# EAGLE design Li-ion charger w protection TP4056 (EAGLE 7.3.0)
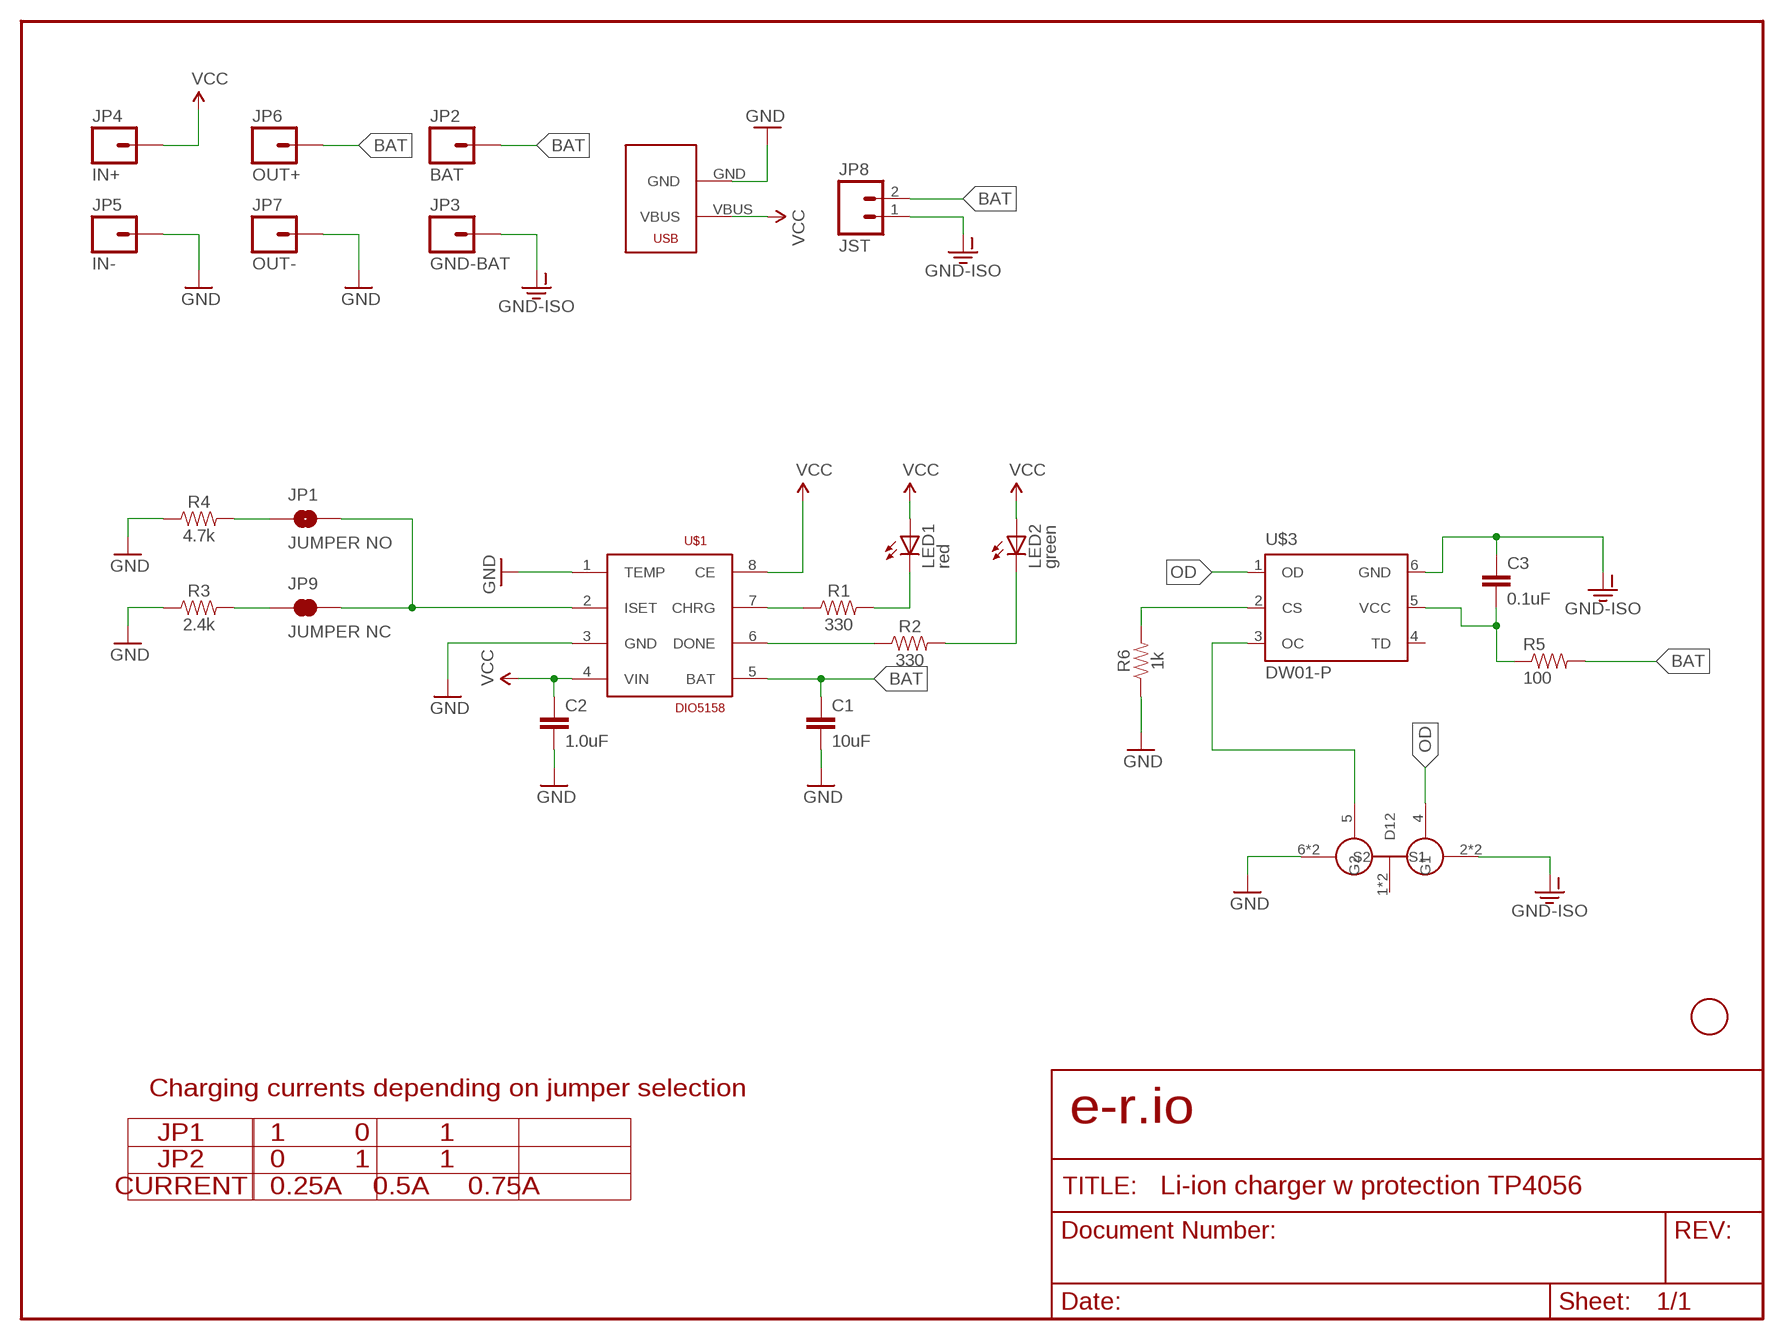
[diagram p0: schematic, sheet 1]

## Parts
C1  10uF  10UF-1206-6.3V-20%  [1206]
C2  1.0uF  1.0UF-0603-16V-10%  [0603]
C3  0.1uF  0.1UF-0603-25V-5%  [0603]
JP1  JUMPER NO  JUMPER-SMT_2_NO_NO-SILK  [SMT-JUMPER_2_NO_NO-SILK]
JP2  BAT  M01PTH  [1X01]
JP3  GND-BAT  M01PTH  [1X01]
JP4  IN+  M01PTH  [1X01]
JP5  IN-  M01PTH  [1X01]
JP6  OUT+  M01PTH  [1X01]
JP7  OUT-  M01PTH  [1X01]
JP8  JST  M02-JST-2MM-SMT  [JST-2-SMD]
JP9  JUMPER NC  JUMPER-SMT_2_NC_TRACE_NO-SILK  [SMT-JUMPER_2_NC_TRACE_NO-SILK]
LED1  red  LEDCHIP-LED0805  [CHIP-LED0805]
LED2  green  LEDCHIP-LED0805  [CHIP-LED0805]
R1  330  330OHM-0603-1/10W-1%  [0603]
R2  330  330OHM-0603-1/10W-1%  [0603]
R3  2.4k  2.49KOHM-0603-1/10W-1%  [0603]
R4  4.7k  4.7KOHM-0603-1/10W-1%  [0603]
R5  100  RESISTOR0603-RES  [0603-RES]
R6  1k  1KOHM-0603-1/10W-1%  [0603]
U$1  DIO5158  [SOIC-8]
U$2  FIDUCIAL  [FIDUCIAL_1MM]
U$3  DW01-P  [SOT23-6L]
U$4  FS8205A  [TSSOP8]
U$5  USB-MICROB-POWERONLY  [USB-MICROB-POWERONLY]

## Nets
BAT: C1.1 JP2.1 JP6.1 JP8.2 R5.2 U$1.5(BAT)
CHRG: R1.1 U$1.7(CHRG)
DONE: R2.1 U$1.6(DONE)
GND: C1.2 C2.2 JP5.1 JP7.1 R3.1 R4.1 R6.1 U$1.1(TEMP) U$1.3(GND) U$4.6(S2) U$4.7(S2) U$5.GND
GND-ISO: C3.1 JP3.1 JP8.1 U$3.6(GND) U$4.2(S1) U$4.3(S1)
ISET: JP1.2 JP9.2 U$1.2(ISET)
LED1: LED1.C R1.2
LED2: LED2.C R2.2
N$1: R6.2 U$3.2(CS)
N$2: U$3.3(OC) U$4.5(G2)
N$8: JP9.1 R3.2
N$9: JP1.1 R4.2
OD: U$3.1(OD) U$4.4(G1)
VCC: C2.1 JP4.1 LED1.A LED2.A U$1.4(VIN) U$1.8(CE) U$5.VBUS
VCC-DW: C3.2 R5.1 U$3.5(VCC)
Unconnected: U$3.4(TD) U$4.1(D12) U$4.8(D12)

## Notes on the sheet
- Charging currents depending on jumper selection
- e-r.io
- JP1
  JP2
  CURRENT
- 1         0         1
  0         1         1
  0.25A    0.5A     0.75A

## Library data of the parts
C1 = SparkFun-Capacitors:10UF: 10.0µF ceramic capacitors A capacitor is a passive two-terminal electrical component used to store electrical energy temporarily in an electric field.; PROD_ID: CAP-10057
C2 = SparkFun-Capacitors:1.0UF: 1µF ceramic capacitors A capacitor is a passive two-terminal electrical component used to store electrical energy temporarily in an electric field.; PROD_ID: CAP-00868
C3 = SparkFun-Capacitors:0.1UF: 0.1µF ceramic capacitors A capacitor is a passive two-terminal electrical component used to store electrical energy temporarily in an electric field.; PROD_ID: CAP-08604
JP1 = SparkFun-Jumpers:JUMPER-SMT_2_NO: Normally open jumper This jumper has two pads in close proximity to each other. Apply solder to close the connection. Round pads are easier to solder for beginners, but are a lot larger. SparkFun Product that uses the round pads: SparkFun EL Sequencer <https://www.sparkfun.com/products/12781>
JP2-JP7 = SparkFun:M01: Header 1 Standard 1-pin 0.1" header. Use with straight break away headers (SKU : PRT-00116), right angle break away headers (PRT-00553), swiss pins (PRT-00743), machine pins (PRT-00117), and female headers (PRT-00115).
JP8 = SparkFun:M02: Header 2 Standard 2-pin 0.1" header. Use with straight break away headers (SKU : PRT-00116), right angle break away headers (PRT-00553), swiss pins (PRT-00743), machine pins (PRT-00117), and female headers (PRT-00115). Molex polarized connector foot print use with SKU : PRT-08233 with associated crimp pins and housings.
JP9 = SparkFun-Jumpers:JUMPER-SMT_2_NC_TRACE: Normally closed trace jumper This jumper has a trace between two pads so it's normally closed (NC). Use a razor knife to open the connection. For best results follow the IPC guidelines for cutting traces: Cutout at least 0.063 mm (0.005 in). Remove all loose material to clean up the cut area. Seal the cut with an approved epoxy. Reapply solder to reclose the connection.
LED1 LED2 = adafruit:LED: LED OSRAM: - CHIPLED LG R971, LG N971, LY N971, LG Q971, LY Q971, LO R971, LY R971 LH N974, LH R974 LS Q976, LO Q976, LY Q976 LO Q996 - Hyper CHIPLED LW Q18S LB Q993, LB Q99A, LB R99A - SideLED LS A670, LO A670, LY A670, LG A670, LP A670 LB A673, LV A673, LT A673, LW A673 LH A674 LY A675 LS A676, LA A676, LO A676, LY A676, LW A676 LS A679, LY A679, LG A679 - Hyper Micro SIDELED® LS Y876, LA Y876, LO Y876, LY Y876 LT Y87S - SmartLED LW L88C, LW L88S LB L89C, LB L89S, LG L890 LS L89K, LO L89K, LY L89K LS L896, LA L896, LO L896, LY L896 - TOPLED LS T670, LO T670, LY T670, LG T670, LP T670 LSG T670, LSP T670, LSY T670, LOP T670, LYG T670 LG T671, LOG T671, LSG T671 LB T673, LV T673, LT T673, LW T673 LH T674 LS T676, LA T676, LO T676, LY T676, LB T676, LH T676, LSB T676, LW T676 LB T67C, LV T67C, LT T67C, LS T67K, LO T67K, LY T67K, LW E67C LS E67B, LA E67B, LO E67B, LY E67B, LB E67C, LV E67C, LT E67C LW T67C LS T679, LY T679, LG T679 LS T770, LO T770, LY T770, LG T770, LP T770 LB T773, LV T773, LT T773, LW T773 LH T774 LS E675, LA E675, LY E675, LS T675 LS T776, LA T776, LO T776, LY T776, LB T776 LHGB T686 LT T68C, LB T68C - Hyper Mini TOPLED® LB M676 - Mini TOPLED Santana® LG M470 LS M47K, LO M47K, LY M47K Source: http://www.osram.convergy.de/
R1 R2 = SparkFun-Resistors:330OHM: 330Ω resistor A resistor is a passive two-terminal electrical component that implements electrical resistance as a circuit element. Resistors act to reduce current flow, and, at the same time, act to lower voltage levels within circuits. - Wikipedia; PROD_ID: RES-00818
R3 = SparkFun-Resistors:2.49KOHM: 2.49kΩ resistor A resistor is a passive two-terminal electrical component that implements electrical resistance as a circuit element. Resistors act to reduce current flow, and, at the same time, act to lower voltage levels within circuits. - Wikipedia; PROD_ID: RES-09568; VALUE: 2.49k
R4 = SparkFun-Resistors:4.7KOHM: 4.7kΩ resistor A resistor is a passive two-terminal electrical component that implements electrical resistance as a circuit element. Resistors act to reduce current flow, and, at the same time, act to lower voltage levels within circuits. - Wikipedia; PROD_ID: RES-07857
R5 = SparkFun:RESISTOR: Resistor Basic schematic elements and footprints for 0603, 1206, and PTH resistors.
R6 = SparkFun-Resistors:1KOHM: 1kΩ resistor A resistor is a passive two-terminal electrical component that implements electrical resistance as a circuit element. Resistors act to reduce current flow, and, at the same time, act to lower voltage levels within circuits. - Wikipedia; PROD_ID: RES-07856
U$1 = ERADIONICA:DIO5158
U$2 = adafruit:FIDUCIAL: For use by pick and place machines to calibrate the vision/machine, 1mm By microbuilder.eu
U$3 = lipo:DW01-P: One Cell Lithium-ion/Polymer Battery Protection IC The DW01-P battery protection IC is designed to protect lithium-ion/polymer battery from damage or degrading the lifetime due to overcharge, overdischarge, and/or overcurrent for one-cell lithium-ion/polymer battery powered systems, such as cellular phones. The ultra-small package and less required external components make it ideal to integrate the DW01-P into the limited space of battery pack. The accurate ±50mV overcharging detection voltage ensures safe and full utilization charging. The very low standby current drains little current from the cell while in storage.
U$4 = SparkFun:FS8205A
U$5 = ERADIONICA:USB-MICROB-POWERONLY

## Board
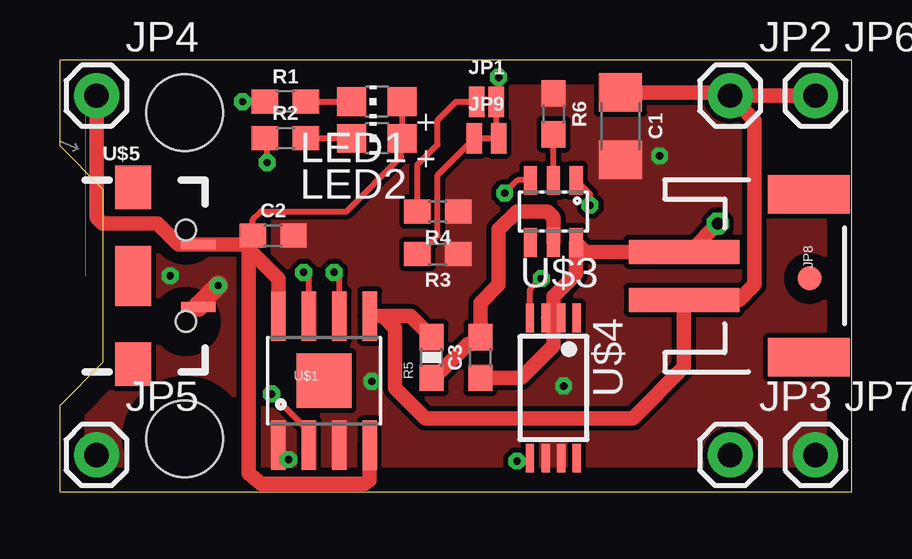
[diagram p1: board, top side]
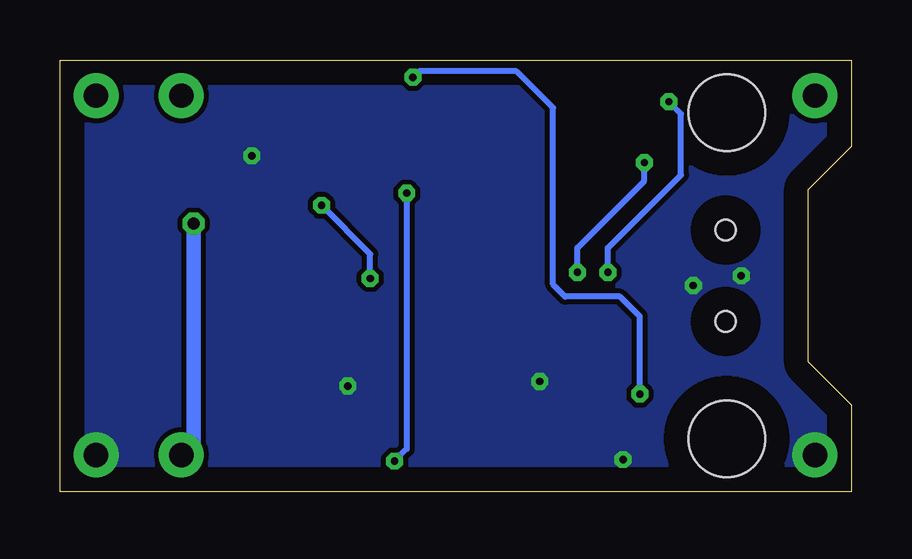
[diagram p2: board, bottom side, seen from below]

Size 33 x 18 mm. Coordinates in mm from the lower left corner, seen from the top.
Outline: 0,0 33,0 33,18 0,18 0,14.4 1.8,12.6 1.8,5.4 0,3.6 0,0
Copper layers (1*16): Top 0.035mm / dielectric 1.5mm / Bottom 0.035mm
Design rules "default *": minimum track width 10mil, minimum drill 24mil, track to track 8mil, track to pad 8mil, pad to pad 8mil, via to via 8mil, smd to smd 8mil, copper to edge 40mil, drill to drill 8mil, minimum pad ring 10mil, minimum via ring 8mil, stop-mask expansion 4mil, vias tented up to drill 0.5mm, thermal gap 10mil
Holes 3.2 mm at 5.2,2.2 5.2,15.8

### Footprints (pad centres in the part's own frame; a part is rotated, then mirrored left to right if it is on the bottom)
1206 = smd 1.6 x 1.8: 1 -1.4,0; 2 1.4,0
0603 = smd 1.1 x 1: 1 -0.85,0; 2 0.85,0
SMT-JUMPER_2_NO_NO-SILK = smd 0.635 x 1.27: 1 -0.406,0; 2 0.406,0
1X01 = drill 1.016 pad 1.88: 1 0,0
JST-2-SMD = smd 1 x 4.6: 1 -1,-3.7; 2 1,-3.7 | smd 1.6 x 3.4: NC1 -3.4,1.5; NC2 3.4,1.5
SMT-JUMPER_2_NC_TRACE_NO-SILK = smd 0.635 x 1.27: 1 -0.508,0; 2 0.508,0
CHIP-LED0805 = smd 1.2 x 1.2: A 0,-1.05; C 0,1.05
0603-RES = smd 1.1 x 1: 1 -0.85,0; 2 0.85,0
SOIC-8 = smd 0.61 x 2.057: 1 -2.07,-2.892; 2 -0.8,-2.892; 3 0.47,-2.892; 4 1.74,-2.892; 5 1.74,2.492; 6 0.47,2.492; 7 -0.8,2.492; 8 -2.07,2.492 | smd 2.286 x 2.286: EPAD -0.165,-0.2
FIDUCIAL_1MM = smd 1 x 1: 1 0,0
SOT23-6L = smd 0.55 x 1.2: 1 -0.95,-1.3; 2 0,-1.3; 3 0.95,-1.3; 4 0.95,1.3; 5 0,1.3; 6 -0.95,1.3
TSSOP8 = smd 1.2 x 0.35: 1 -2.925,0.975; 2 -2.925,0.325; 3 -2.925,-0.325; 4 -2.925,-0.975; 5 2.925,-0.975; 6 2.925,-0.325; 7 2.925,0.325; 8 2.925,0.975
USB-MICROB-POWERONLY = smd 1.45 x 0.4: GND 1.455,-1.3; VBUS 1.455,1.3 | smd 1.5 x 1.8: SHIELD1 -1.27,3.685; SHIELD2 -1.27,-3.685 | smd 1.5 x 2.5: SHIELD3 -1.27,0 | hole 0.85: 0.93,1.9; 0.93,-1.9

### Placement (x,y rotation side)
C1  23.37,15.24 270 top
C2  8.89,10.67 0 top
C3  17.53,5.59 90 top
JP1  17.78,16.26 0 top
JP2  27.94,16.51 0 top
JP3  27.94,1.52 0 top
JP4  1.52,16.51 0 top
JP5  1.52,1.52 0 top
JP6  31.5,16.51 0 top
JP7  31.5,1.52 0 top
JP8  29.72,9 270 top
JP9  17.78,14.73 0 top
LED1  13.21,16.26 90 top
LED2  13.21,14.73 90 top
R1  9.4,16.26 0 top
R2  9.4,14.73 0 top
R3  15.75,9.91 180 top
R4  15.75,11.68 180 top
R5  15.49,5.59 90 top
R6  20.57,15.75 270 top
U$1  11.18,4.83 0 top
U$2  31.24,8.89 0 top
U$3  20.57,11.68 180 top
U$4  20.57,4.32 270 top
U$5  4.32,9 0 top
U$6  [LOGO-3MM]  23,1.6 0 top
U$7  [E-R.IO-3MM]  23,0.6 0 top
U$8  [OSH-3MM]  10.8,9.8 0 top
U$9  [LOGO-BACK-6MM]  13.6,10.4 0 top
U$10  [E-R.IO-BACK-6MM]  13.6,8.4 0 top

### Tracks (layer width: path | path; a pad name or v marks a point on that pad's centre or on a via)
BAT
  Top 0.61: U$1.5 13.46,7.32 | 13.46,7.32 14.61,7.32 R5.2 | 13.46,7.32 13.97,6.81 13.97,4.32 15.24,3.05 23.88,3.05 26.02,5.19 JP8.2 28.32,8 28.96,8.64 28.96,15.49 JP2.1 | C1.1 27.81,16.64 JP2.1 | JP6.1 JP2.1
CHRG  (via drill 0.3)
  Top 0.254: U$1.7 10.38,8.93 v10.16,9.14 | v7.62,16.26 R1.1
  Bottom 0.254: v10.16,9.14 10.16,10.16 7.11,13.21 7.11,15.75 v7.62,16.26
DONE  (via drill 0.3)
  Top 0.254: U$1.6 11.65,8.93 v11.43,9.14 | v8.64,13.72 8.64,14.64 R2.1
  Bottom 0.254: v11.43,9.14 11.43,10.16 8.64,12.95 v8.64,13.72
GND  (via drill 0.3)
  Top 0.813: U$5.GND 5.77,7.77 v6.6,8.6
  other vias: 4.6,9 21,4.4 13,4.6 9.53,1.33 25,14
  pour Bottom (no thermals): 0,0 33,0 33,18 0,18
  pour Top (no thermals): 0,18 0,0 33,0 33,18
GND-ISO  (via drill 0.5)
  Top 0.254: 20.57,6.86 20.57,6.91 U$4.3
  Top 0.4: 20.57,7.57 U$4.3 U$4.2
  Top 0.61: 20.57,7.57 20.57,8.13 21.52,9.07 U$3.6 21.9,10 JP8.1 26.26,10 v27.43,11.18 | C3.1 19.22,4.74 20.57,6.1 20.57,6.86
  Bottom 0.61: v27.43,11.18 27.43,2.03 JP3.1
ISET  (via drill 0.3)
  Top 0.254: U$1.2 10.38,2.51 v8.83,4.06 | v18.29,17.27 18.29,16.36 JP1.2 18.19,14.83 JP9.2
  Bottom 0.254: v8.83,4.06 8.83,7.3 9.65,8.13 11.94,8.13 12.45,8.64 12.45,16 13.97,17.53 18.03,17.53 v18.29,17.27
LED1
  Top 0.254: R1.2 LED1.C
LED2
  Top 0.254: R2.2 LED2.C
N$1
  Top 0.254: U$3.2 R6.2
N$2  (via drill 0.3)
  Top 0.254: U$3.3 19.08,12.98 v18.54,12.45 | v19.05,1.27 19.47,1.27 U$4.5
  Bottom 0.254: v18.54,12.45 18.54,1.78 v19.05,1.27
N$8
  Top 0.254: R3.2 14.99,9.91 15.75,10.67 15.75,13.21 JP9.1
N$9
  Top 0.254: R4.2 14.9,13.63 15.75,14.48 15.75,15.49 16.51,16.26 JP1.1
OD  (via drill 0.3)
  Top 0.254: U$4.4 19.59,8.42 v20.07,8.89 | v22.1,11.94 22.1,12.4 U$3.1
  Bottom 0.254: v20.07,8.89 20.07,9.91 v22.1,11.94
VCC
  Top 0.254: LED1.A LED2.A 14.22,14.7 14.22,13.97 11.94,11.68 8.38,11.68 8.04,11.34 C2.1
  Top 0.61: 7.67,10.3 U$5.VBUS 4.94,10.3 4.06,11.18 1.78,11.18 1.52,11.43 JP4.1 | 7.67,10.3 C2.1 7.87,10.5 7.87,0.76 8.38,0.32 12.7,0.32 12.92,0.47 U$1.4 | U$1.8 9.11,8.87 7.67,10.3
VCC-DW
  Top 0.61: R5.1 15.6,4.74 17.02,6.16 17.25,6.16 C3.2 17.53,7.87 18.29,8.64 18.29,10.92 19.05,11.68 20.32,11.68 20.57,11.43 U$3.5

### Text on the board
200bmp: CHRG | JP1 | IN+ | JP2 | BAT+ | OUT+ | DONE | IN- | BAT- | OUT-
208bmp: IN+ | BAT+ | OUT+ | IN- | BAT- | OUT- | Lithium battery charger / with protection